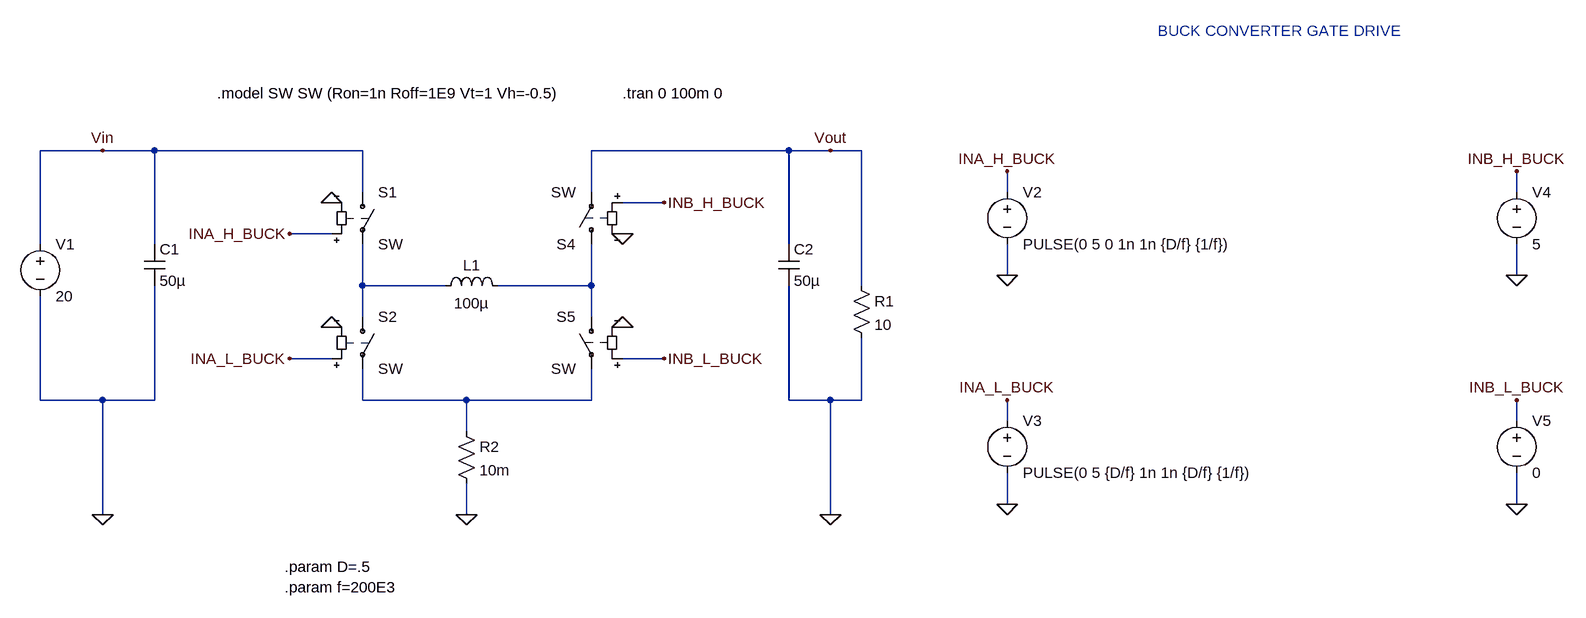
[diagram p0: schematic 4_sw_converter_buck.asc]
4_sw_converter_buck.asc, the LTspice schematic file:
Version 4
SHEET 1 2376 1432
WIRE 32 -48 -64 -48
WIRE 112 -48 32 -48
WIRE 432 -48 112 -48
WIRE 1088 -48 784 -48
WIRE 1152 -48 1088 -48
WIRE 1200 -48 1152 -48
WIRE 432 16 432 -48
WIRE 784 16 784 -48
WIRE 1424 16 1424 -16
WIRE 2208 16 2208 -16
WIRE 896 32 832 32
WIRE 384 80 320 80
WIRE -64 96 -64 -48
WIRE 112 96 112 -48
WIRE 1088 96 1088 -48
WIRE 1424 144 1424 96
WIRE 2208 144 2208 96
WIRE 432 160 432 96
WIRE 560 160 432 160
WIRE 784 160 784 96
WIRE 784 160 640 160
WIRE 1200 160 1200 -48
WIRE 432 208 432 160
WIRE 784 208 784 160
WIRE 384 272 320 272
WIRE 896 272 832 272
WIRE -64 336 -64 176
WIRE 32 336 -64 336
WIRE 112 336 112 160
WIRE 112 336 32 336
WIRE 432 336 432 288
WIRE 592 336 432 336
WIRE 784 336 784 288
WIRE 784 336 592 336
WIRE 1088 336 1088 160
WIRE 1152 336 1088 336
WIRE 1200 336 1200 240
WIRE 1200 336 1152 336
WIRE 1424 368 1424 336
WIRE 2208 368 2208 336
WIRE 592 384 592 336
WIRE 1424 496 1424 448
WIRE 2208 496 2208 448
WIRE 32 512 32 336
WIRE 592 512 592 464
WIRE 1152 512 1152 336
FLAG 592 512 0
FLAG 32 512 0
FLAG 1152 512 0
FLAG 1152 -48 Vout
FLAG 32 -48 Vin
FLAG 320 272 INA_L_BUCK
FLAG 896 32 INB_H_BUCK
FLAG 896 272 INB_L_BUCK
FLAG 1424 -16 INA_H_BUCK
FLAG 1424 336 INA_L_BUCK
FLAG 2208 -16 INB_H_BUCK
FLAG 2208 336 INB_L_BUCK
FLAG 1424 144 0
FLAG 1424 496 0
FLAG 2208 144 0
FLAG 2208 496 0
FLAG 320 80 INA_H_BUCK
FLAG 832 80 0
FLAG 832 224 0
FLAG 384 224 0
FLAG 384 32 0
SYMBOL voltage -64 80 R0
WINDOW 123 0 0 Left 0
WINDOW 39 0 0 Left 0
SYMATTR InstName V1
SYMATTR Value 20
SYMBOL ind 544 176 R270
WINDOW 0 32 56 VTop 2
WINDOW 3 5 56 VBottom 2
SYMATTR InstName L1
SYMATTR Value 100µ
SYMBOL cap 96 96 R0
SYMATTR InstName C1
SYMATTR Value 50µ
SYMBOL cap 1072 96 R0
SYMATTR InstName C2
SYMATTR Value 50µ
SYMBOL voltage 1424 0 R0
WINDOW 123 0 0 Left 0
WINDOW 39 0 0 Left 0
SYMATTR InstName V2
SYMATTR Value PULSE(0 5 0 1n 1n {D/f} {1/f})
SYMBOL voltage 1424 352 R0
WINDOW 123 0 0 Left 0
WINDOW 39 0 0 Left 0
SYMATTR InstName V3
SYMATTR Value PULSE(0 5 {D/f} 1n 1n {D/f} {1/f})
SYMBOL voltage 2208 0 R0
WINDOW 123 0 0 Left 0
WINDOW 39 0 0 Left 0
SYMATTR InstName V4
SYMATTR Value 5
SYMBOL voltage 2208 352 R0
WINDOW 123 0 0 Left 0
WINDOW 39 0 0 Left 0
SYMATTR InstName V5
SYMATTR Value 0
SYMBOL sw 432 0 R0
SYMATTR InstName S1
SYMBOL sw 432 192 R0
SYMATTR InstName S2
SYMBOL sw 784 112 R180
SYMATTR InstName S4
SYMBOL sw 784 192 M0
SYMATTR InstName S5
SYMBOL res 1184 144 R0
SYMATTR InstName R1
SYMATTR Value 10
SYMBOL res 576 368 R0
SYMATTR InstName R2
SYMATTR Value 10m
TEXT 1656 -232 Left 2 ;BUCK CONVERTER GATE DRIVE
TEXT 832 -136 Left 2 !.tran 0 100m 0
TEXT 208 -136 Left 2 !.model SW SW (Ron=1n Roff=1E9 Vt=1 Vh=-0.5)
TEXT 312 592 Left 2 !.param D=.5
TEXT 312 624 Left 2 !.param f=200E3

The netlist it stands for:
* 4_sw_converter_buck.asc
V1 Vin 0 20
L1 N001 N002 100µ
C1 Vin 0 50µ
C2 Vout 0 50µ
V2 INA_H_BUCK 0 PULSE(0 5 0 1n 1n {D/f} {1/f})
V3 INA_L_BUCK 0 PULSE(0 5 {D/f} 1n 1n {D/f} {1/f})
V4 INB_H_BUCK 0 5
V5 INB_L_BUCK 0 0
S1 Vin N001 INA_H_BUCK 0 SW
S2 N001 N003 INA_L_BUCK 0 SW
S4 N002 Vout INB_H_BUCK 0 SW
S5 N002 N003 INB_L_BUCK 0 SW
R1 Vout 0 10
R2 N003 0 10m
* BUCK CONVERTER GATE DRIVE
.tran 0 100m 0
.model SW SW (Ron=1n Roff=1E9 Vt=1 Vh=-0.5)
.param D=.5
.param f=200E3
.backanno
.end